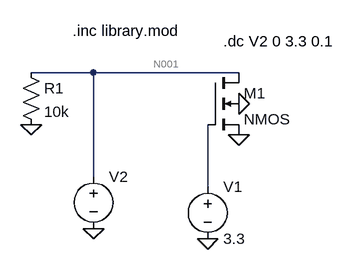
[diagram p0: schematic Draft1.asc]
Draft1.asc, the LTspice schematic file:
Version 4
SHEET 1 880 680
WIRE 48 112 -48 112
WIRE 272 112 48 112
WIRE 48 272 48 112
WIRE 224 288 224 192
FLAG 272 160 0
FLAG 272 208 0
FLAG -48 192 0
FLAG 48 352 0
FLAG 224 368 0
SYMBOL res -64 96 R0
SYMATTR InstName R1
SYMATTR Value 10k
SYMBOL voltage 224 272 R0
WINDOW 123 0 0 Left 0
WINDOW 39 0 0 Left 0
SYMATTR InstName V1
SYMATTR Value 3.3
SYMBOL voltage 48 256 R0
SYMATTR InstName V2
SYMATTR Value ""
SYMBOL nmos4 224 112 R0
SYMATTR InstName M1
SYMATTR Value2 l=0.4u w=0.4u
TEXT 16 48 Left 2 !.inc library.mod
TEXT 248 64 Left 2 !.dc V2 0 3.3 0.1

The netlist it stands for:
* Draft1.asc
R1 N001 0 10k
V1 N002 0 3.3
V2 N001 0
M1 N001 N002 0 0 NMOS l=0.4u w=0.4u
.model NMOS NMOS
.model PMOS PMOS
.lib standard.mos
.inc library.mod
.dc V2 0 3.3 0.1
.backanno
.end

* Results of the author's LTspice run, read from the files saved beside the schematic
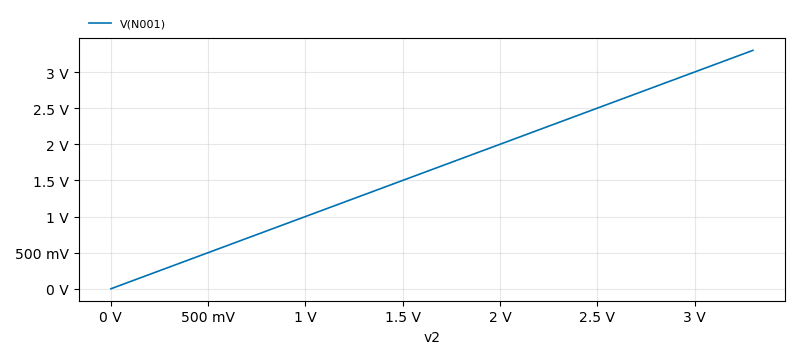
[diagram p1: DC transfer characteristic of Draft1.asc, plotted from the saved traces]
* DC transfer characteristic, 1 run:
*   V(N001): 0 V at v2=0 V, 3.3 V at v2=3.3 V, min 0 V, max 3.3 V